# EasyEDA schematic 8266 NFC reader.json
TITLE: Sheet_1; REV: 1.0; Date: 2022-09-02; Sheet: 1/1; Company: Your Company
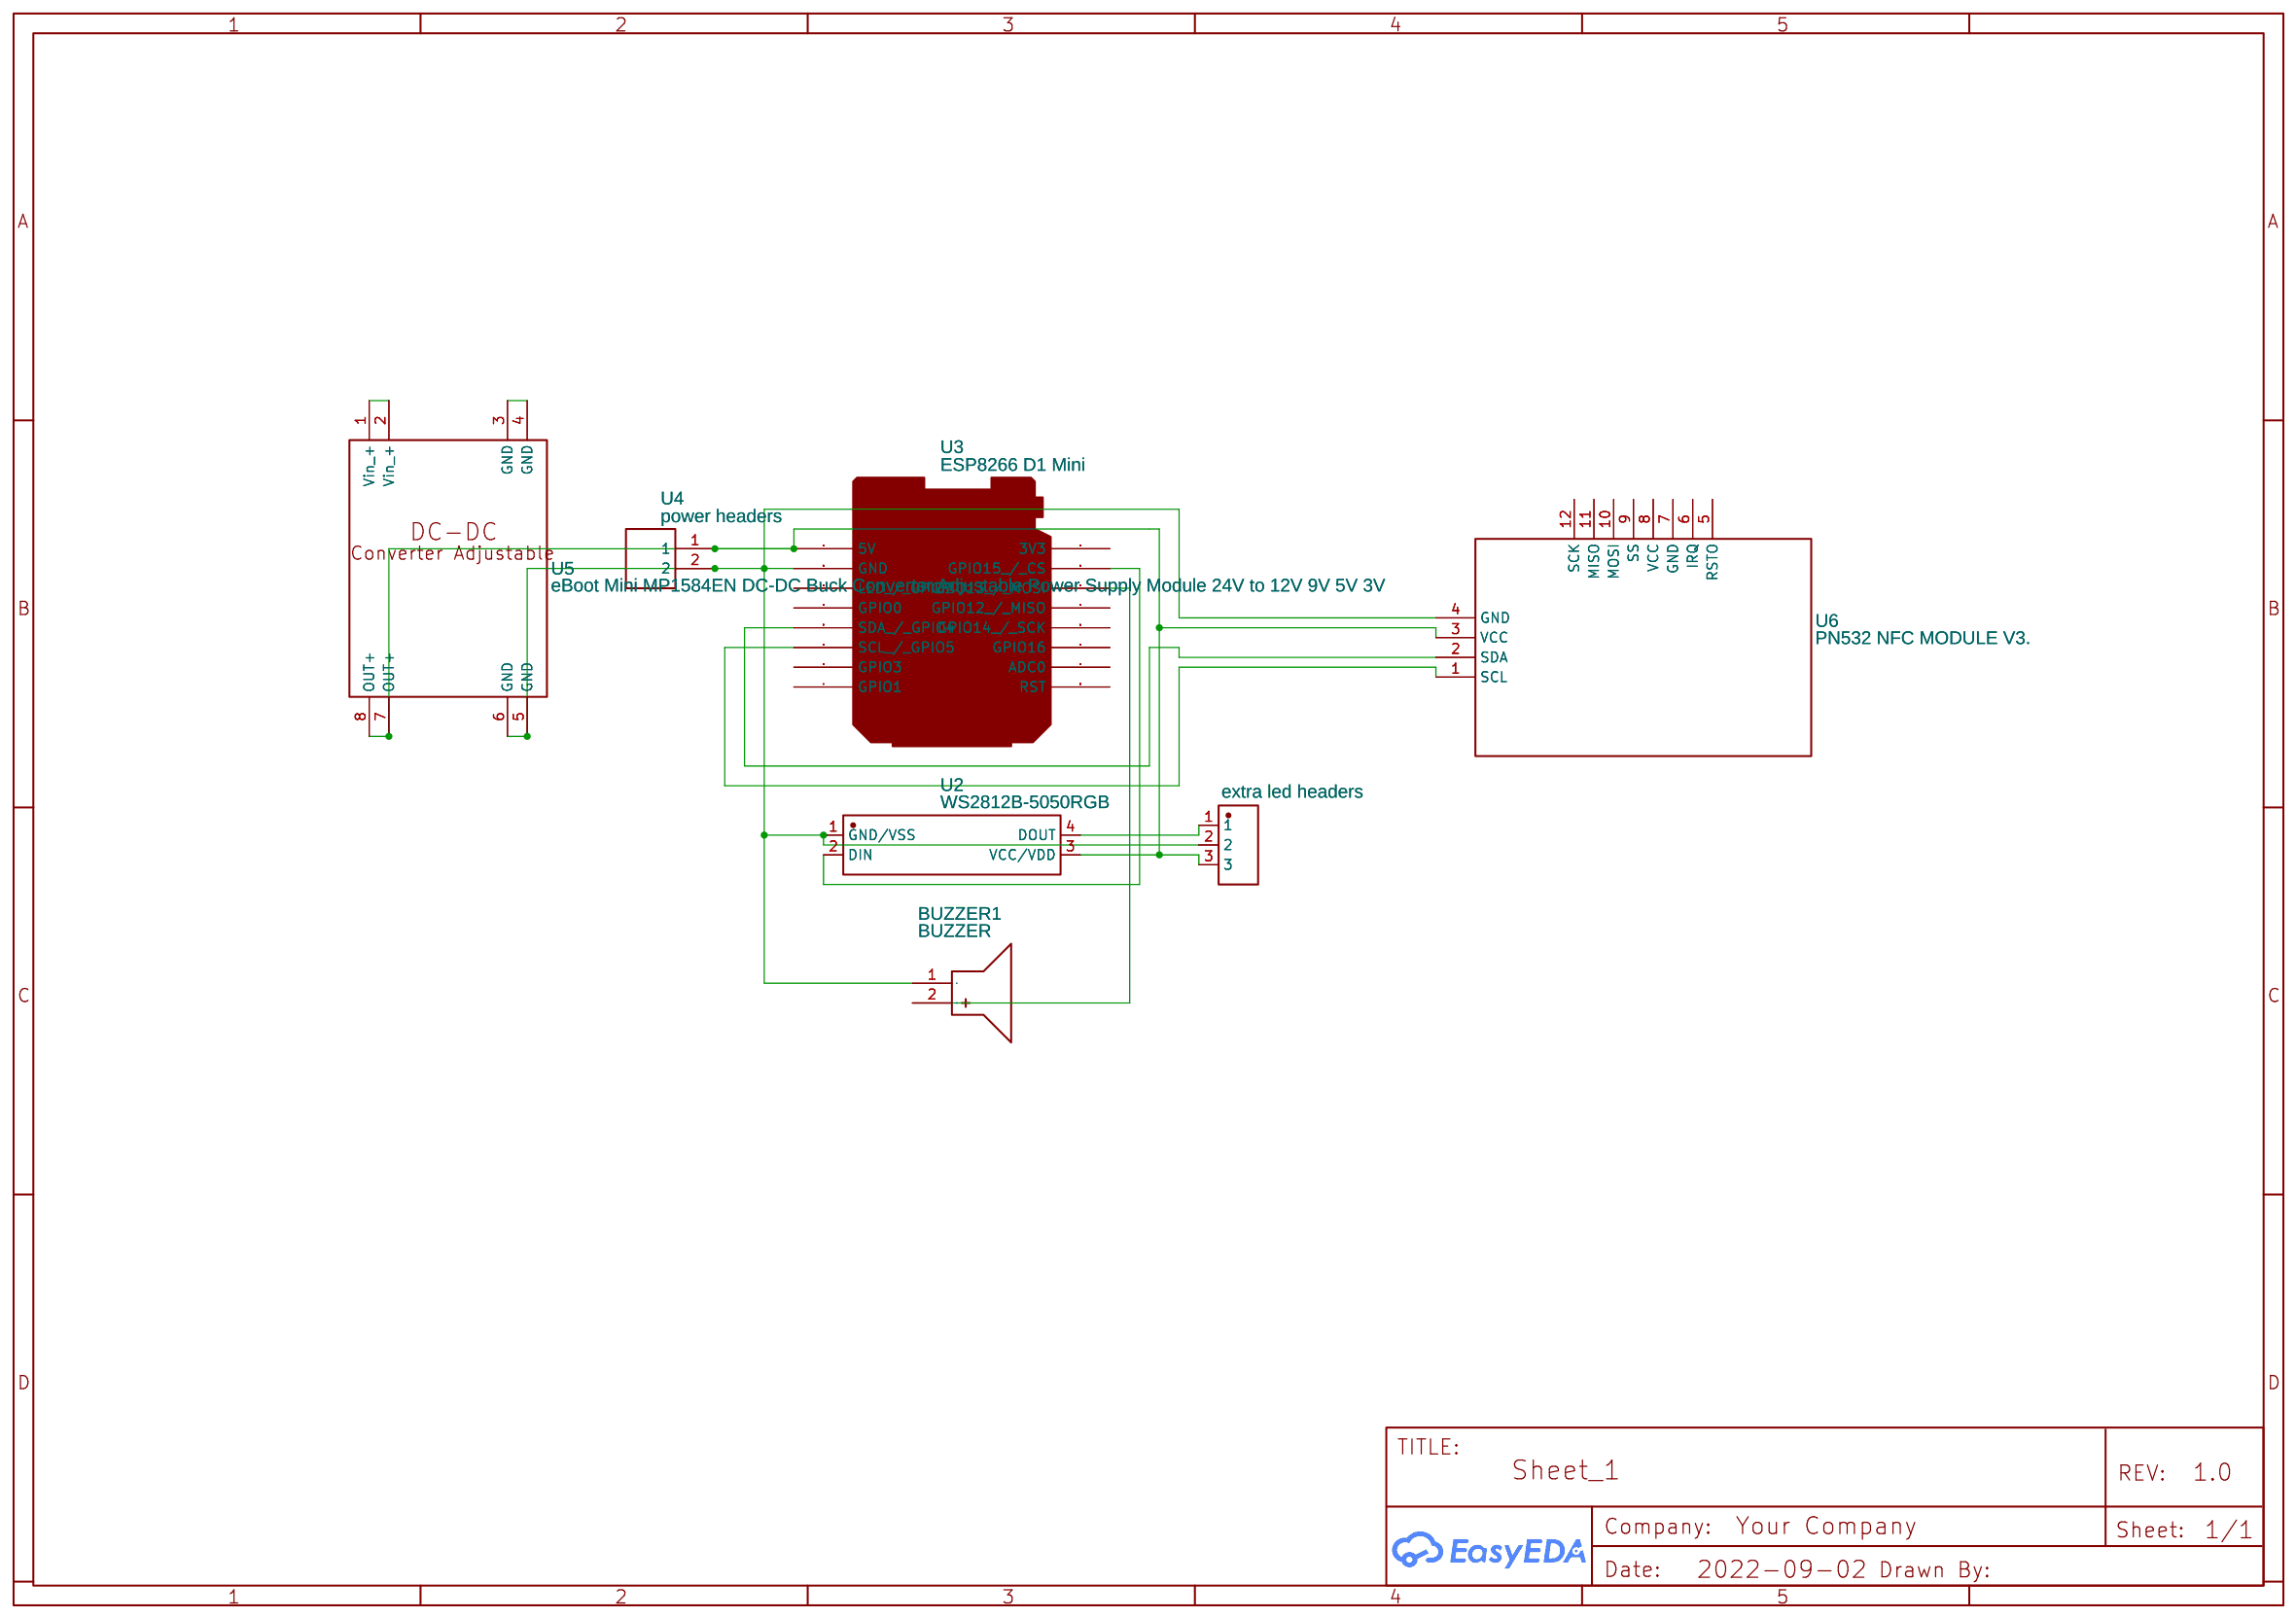
[diagram p0: schematic sheet]

## Parts
1  extra led headers  [PIN HEADERS 1X3 P P=2.54MM DROIT M]
BUZZER1  BUZZER  [BUZ-TH_BD12.0-P6.00-D0.9-RD]
U2  WS2812B-5050RGB  [LED-SMD_4P-L5.0-W5.0-BR_WS2812B-5050RGB]
U3  ESP8266 D1 Mini  [ESP8266 D1 MINI]
U4  power headers  [1X2 HEADERS 2.54MM PITCH]
U5  eBoot Mini MP1584EN DC-DC Buck Converter Adjustable Power Supply Module 24V to 12V 9V 5V 3V  [DC-DC BUCK CONVERTER]
U6  PN532 NFC MODULE V3.  [PN532 WITH HOLES MARKED]

## Library data of the parts
1 = Pin Headers 1x03 P P=2.54mm Droit M: link: https://lcsc.com/product-detail/Pin-Headers_XKB-Connectivity-X6511WV-02H-C30D60_C706874.html; Contributor: stéphane royer
BUZZER1 = BUZZER: Supplier: LCSC; Supplier Part: C9900014030; Manufacturer: null; Manufacturer Part: buzzer; JLCPCB Part Class: Extended Part; Contributor: lcsc
U2 = WS2812B-5050RGB: Supplier: LCSC; Supplier Part: C2838584; Manufacturer: null; JLCPCB Part Class: Extended Part; Contributor: LCSC
U3 = ESP8266 D1 Mini: Contributor: deltaone99
U4 = 1X2 HEADERS 2.54MM PITCH: Supplier Part: 7106; Contributor: Ksel92
U5 = eBoot Mini MP1584EN DC-DC Buck Converter Adjustable Power Supply Module 24V to 12V 9V 5V 3V: link: https://www.amazon.com/gp/product/B01MQGMOKI/; Contributor: remtryt
U6 = PN532 NFC MODULE V3.: link: http://www.elechouse.com/elechouse/images/product/PN532_module_V3/PN532_%20Manual_V3.pdf; Contributor: CZValencia14

## Nets
Net-(1-1): 1.1 U2.4(DOUT)
Net-(1-2): 1.2 BUZZER1.1(-) U2.1(GND/VSS) U3.GND U4.2 U5.5(GND) U5.6(GND) U6.4(GND)
Net-(1-3): 1.3 U2.3(VCC/VDD) U3.5V U4.1 U5.7(OUT+) U5.8(OUT+) U6.3(VCC)
Net-(BUZZER1-2): BUZZER1.2(+) U3.D7(GPIO13 / MOSI)
Net-(U2-2): U2.2(DIN) U3.D8(GPIO15 / CS)
Net-(U3-D1): U3.D1(SCL / GPIO5) U6.1(SCL)
Net-(U3-D2): U3.D2(SDA / GPIO4) U6.2(SDA)
Net-(U5-1): U5.1(Vin +) U5.2(Vin +)
Net-(U5-3): U5.3(GND) U5.4(GND)

Not connected (* = marked no-connect by the designer): U3 3V3 A0(ADC0) D0(GPIO16) D3(GPIO0) D4(LED / GPIO2) D5(GPIO14 / SCK) D6(GPIO12 / MISO) RST RX(GPIO3) TX(GPIO1); U6 5(RSTO) 6(IRQ) 7(GND) 8(VCC) 9(SS) 10(MOSI) 11(MISO) 12(SCK)
